# EAGLE design pigtrotr (EAGLE 9.6.2)
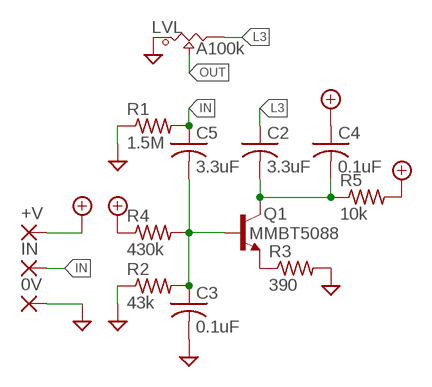
[diagram p0: schematic, sheet 1]

## Parts
0V  SMD2  [SMD1,27-2,54]
+V  SMD2  [SMD1,27-2,54]
C2  3.3uF  C-USC0805  [C0805]
C3  0.1uF  C-USC0603  [C0603]
C4  0.1uF  C-USC0603  [C0603]
C5  3.3uF  C-USC1206  [C1206]
IN  SMD2  [SMD1,27-2,54]
LVL  A100k  POT_9MM_SMD  [POT_9MM_SMD]
Q1  MMBT5088  [SOT23-BEC]
R1  1.5M  R-US_R0603  [R0603]
R2  43k  R-US_R0603  [R0603]
R3  390  R-US_R0603  [R0603]
R4  430k  R-US_R0603  [R0603]
R5  10k  R-US_R0603  [R0603]

## Nets
+9V: +V.1(P) C4.1 R4.1 R5.2
GND: 0V.1(P) C3.2 LVL.1 R1.1 R2.1 R3.2
IN: C5.1 IN.1(P) R1.2
L3: C2.1 LVL.3
N$1: Q1.E R3.1
N$2: C3.1 C5.2 Q1.B R2.2 R4.2
N$3: C2.2 C4.2 Q1.C R5.1
OUT: LVL.2

## Library data of the parts
0V +V IN = wirepad:SMD2: SMD PAD
C2-C5 = adafruit:C-US: CAPACITOR, American symbol
LVL = Mech_BO_CE_SW:POT_9MM_SMD
Q1 = MMBT5088_:MMBT5088*: NPN TRANSISTOR Check prices <https://pricing.snapeda.com/search/part/MMBT5088/?ref=eda>; AVAILABILITY: Good; DESCRIPTION: Bipolar (BJT) Transistor NPN 30V 100mA 50MHz 350mW Surface Mount SOT-23; MF: ON Semiconductor; MP: MMBT5088; PACKAGE: SOT-23-3 Fairchild Semiconductor; PRICE: None; PURCHASE-URL: https://pricing.snapeda.com/search/part/MMBT5088/?ref=eda
R1-R5 = adafruit:R-US_: RESISTOR, American symbol

## Board
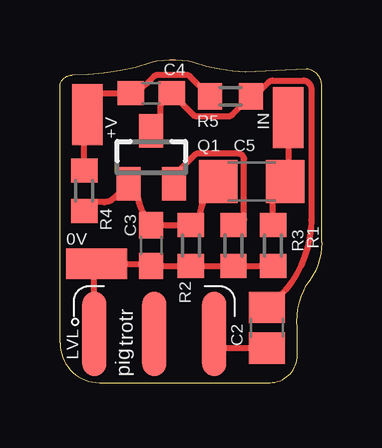
[diagram p1: board, top side]

Size 10.92 x 13.46 mm. Coordinates in mm from the lower left corner, seen from the top.
Outline: 0,1.65 arc90 1.65,0 8.76,0 arc90 9.91,1.14 9.91,2.29 arc-35 10.29,4.06 arc39 10.92,5.84 10.92,12.32 arc90 10.29,13.08 7.75,12.95 arc-16 5.59,13.34 arc33 3.81,13.34 arc-19 0.51,12.83 arc90 0,12.32 0,1.65
Copper layers (1*16): Top 0.035mm / dielectric 1.5mm / Bottom 0.035mm
Design rules "default *": minimum track width 6mil, minimum drill 0.35mm, track to track 6mil, track to pad 6mil, pad to pad 6mil, via to via 6mil, smd to smd 6mil, copper to edge 10mil, drill to drill 6mil, minimum pad ring 10mil, minimum via ring 8mil, stop-mask expansion 4mil, vias tented up to drill 0mil, thermal gap 10mil

### Footprints (pad centres in the part's own frame; a part is rotated, then mirrored left to right if it is on the bottom)
SMD1,27-2,54 = smd 1.27 x 2.54: 1 0,0
C0805 = smd 1.3 x 1.5: 1 -0.85,0; 2 0.85,0
C0603 = smd 1.1 x 1: 1 -0.85,0; 2 0.85,0
C1206 = smd 1.6 x 1.8: 1 -1.4,0; 2 1.4,0
POT_9MM_SMD = smd 0.991 x 3.505: 1 -2.5,0; 2 0,0; 3 2.5,0
SOT23-BEC = smd 1 x 1.4: B -0.95,-1.1; C 0,1.1; E 0.95,-1.1
R0603 = smd 1 x 1.1: 1 -0.85,0; 2 0.85,0

### Placement (x,y rotation side)
0V  1.52,4.95 90 top
+V  1.14,11.18 0 top
C2  8.64,2.29 90 top
C3  3.81,5.71 270 top
C4  3.81,12.06 0 top
C5  8,8.38 180 top
IN  9.53,11.05 180 top
LVL  3.94,2.03 0 top
Q1  3.81,9.4 0 top
R1  8.89,5.71 90 top
R2  5.46,5.71 90 top
R3  7.24,5.71 270 top
R4  1.02,8 270 top
R5  7.11,11.94 180 top

### Tracks (layer width: path | path; a pad name or v marks a point on that pad's centre or on a via)
+9V
  Top 0.254: R4.1 1.02,11.05 +V.1 1.14,11.68 1.52,12.06 C4.1 3.21,12.06 3.92,12.77 arc-45 4.1,12.84 5.25,12.84 arc-45 5.43,12.77 R5.2
GND
  Top 0.254: LVL.1 1.44,4.87 0V.1 3.72,4.95 C3.2 R2.1 R3.2 R1.1
IN
  Top 0.254: IN.1 9.53,8.63 9.4,8.51 C5.1 8.89,7.87 R1.2
L3
  Top 0.254: C2.1 6.44,1.44 LVL.3
N$1
  Top 0.254: R3.1 7.43,6.57 arc90 7.68,6.82 7.68,9.31 arc90 7.43,9.56 5.79,9.56 arc45 5.61,9.49 4.76,8.64 Q1.E | Q1.E
N$2
  Top 0.254: R4.2 1.4,7.53 1.84,7.53 1.84,7.54 arc45 2.28,7.72 Q1.B 3.24,7.92 arc45 3.71,6.8 3.81,6.69 C3.1 R2.2 5.84,6.95 arc-45 6.23,7.88 6.41,8.06 6.41,8.19 C5.2
N$3
  Top 0.254: Q1.C 4.19,10.88 4.19,11.49 arc-45 4.26,11.67 C4.2 5.54,11.18 arc45 5.72,11.11 7.03,11.11 arc45 7.21,11.18 R5.1 8.11,11.94 8.7,12.52 arc-45 8.88,12.6 10.17,12.6 arc-45 10.35,12.52 10.41,12.47 arc-45 10.48,12.29 10.48,6.78 arc-45 9.15,3.58 9.08,3.58 C2.2

### Text on the board
tPlace: trotr | pig